# EAGLE design ISRelayV01 (EAGLE 5.06)
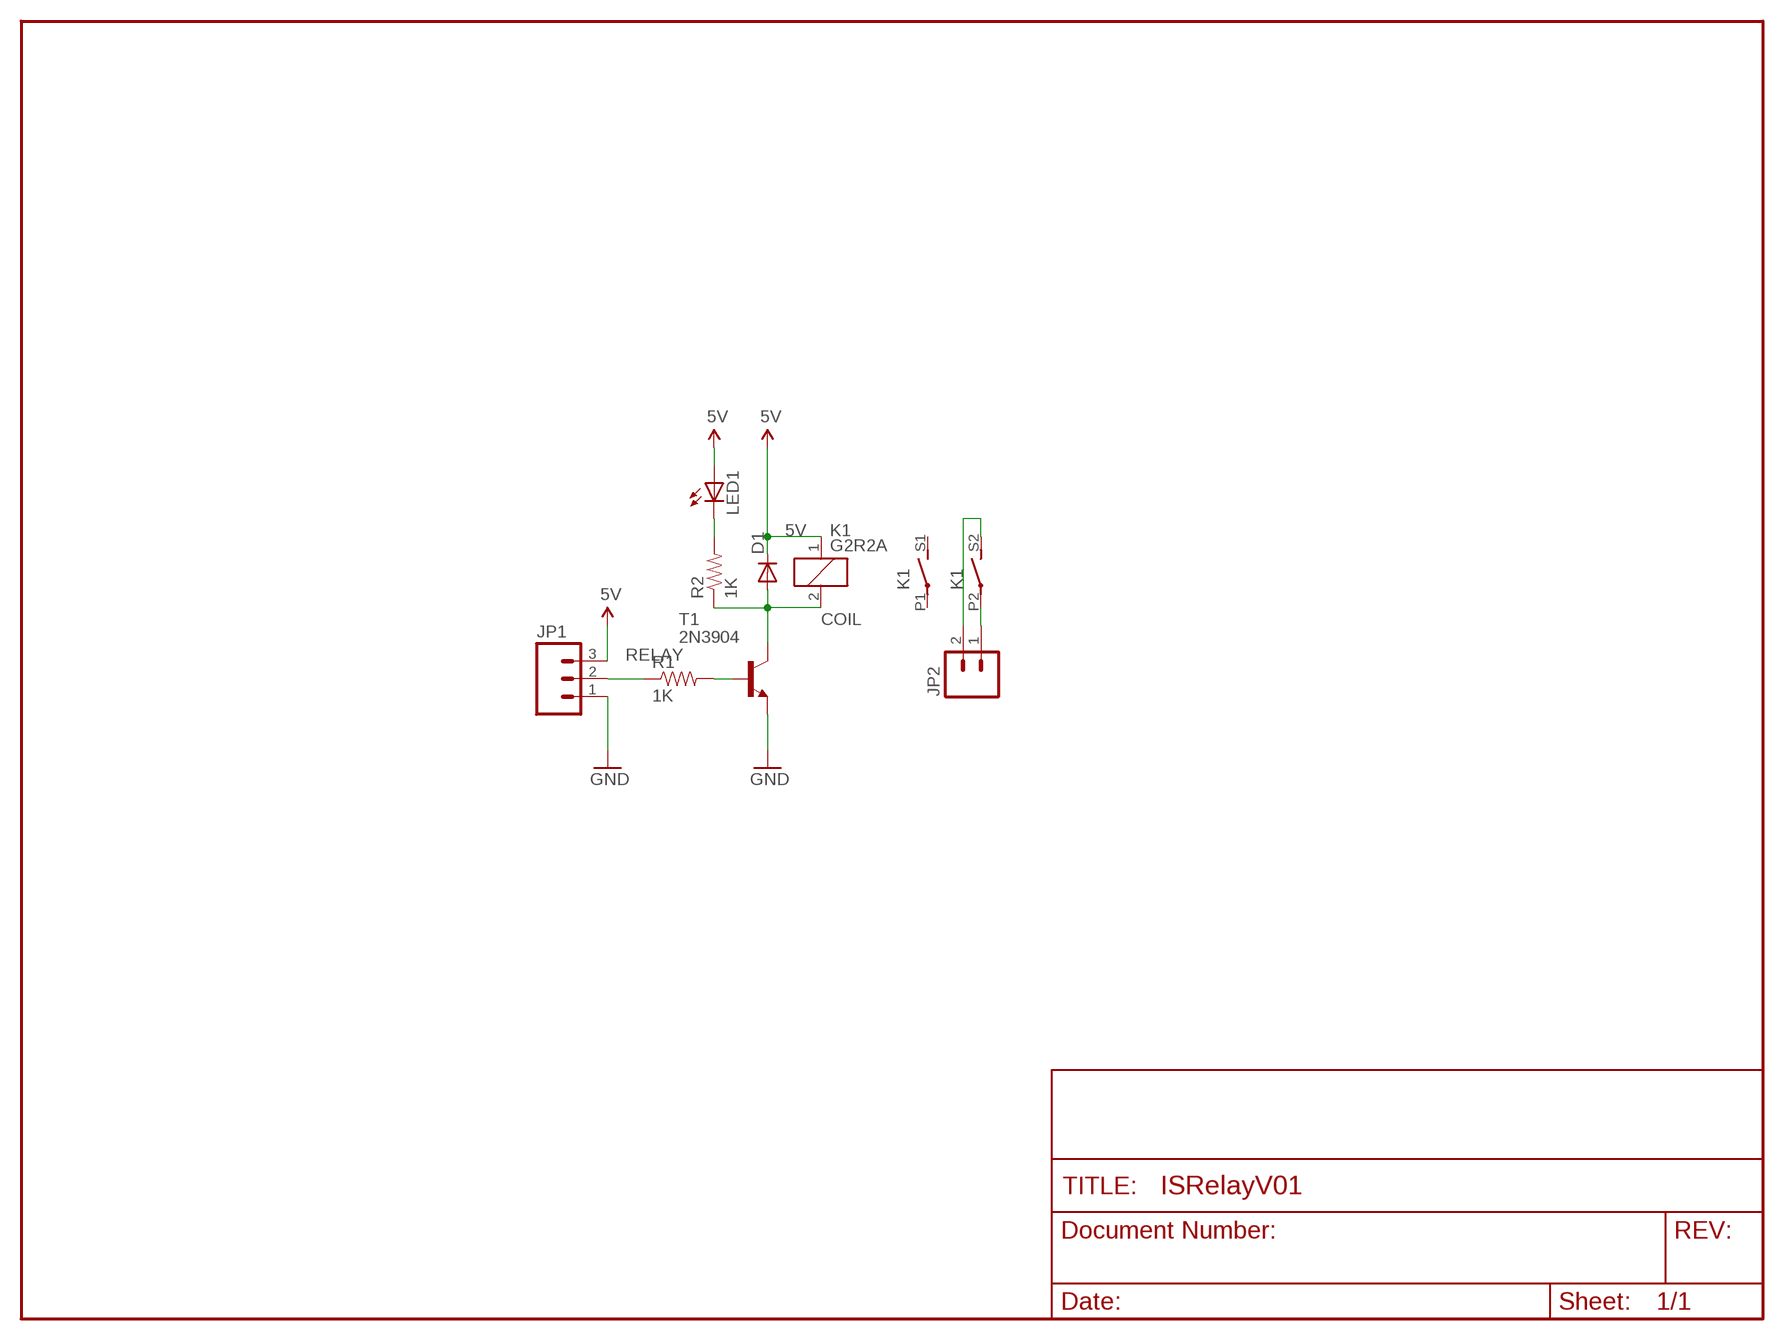
[diagram p0: schematic, sheet 1]

## Parts
D1  DIODE1N4148  [DIODE-1N4148]
JP1  M03SCREW  [SCREWTERMINAL-3.5MM-3]
JP2  M025MM  [SCREWTERMINAL-5MM-2]
K1  G2R2A  [G2R2A]
LED1  LED5MM  [LED5MM]
R1  1K  RESISTORAXIAL-0.3  [AXIAL-0.3]
R2  1K  RESISTORAXIAL-0.3  [AXIAL-0.3]
T1  2N3904  [TO92]

## Nets
5V: D1.C JP1.3 K1.1 LED1.A
COIL: D1.A K1.2 R2.P$1 T1.1(C)
GND: JP1.1 T1.3(E)
N$1: JP2.1 K1.P2(3:P)
N$2: R1.P$2 T1.2(B)
N$3: JP2.2 K1.S2(3:S)
N$4: LED1.K(C) R2.P$2
RELAY: JP1.2 R1.P$1
Unconnected: K1.P1(2:P) K1.S1(2:S)

## Library data of the parts
D1 = SparkFun:DIODE: Diode These are standard reverse protection diodes and small signal diodes. SMA package can handle up to about 1A. SOD-323 can handle about 200mA. What the SOD-323 package when ordering, there are some mfgs out there that are 5-pin packages.
JP1 = SparkFun:M03: Header 3 Standard 3-pin 0.1" header. Use with straight break away headers (SKU : PRT-00116), right angle break away headers (PRT-00553), swiss pins (PRT-00743), machine pins (PRT-00117), and female headers (PRT-00115). Molex polarized connector foot print use with SKU : PRT-08232 with associated crimp pins and housings.
JP2 = SparkFun:M02: Header 2 Standard 2-pin 0.1" header. Use with straight break away headers (SKU : PRT-00116), right angle break away headers (PRT-00553), swiss pins (PRT-00743), machine pins (PRT-00117), and female headers (PRT-00115). Molex polarized connector foot print use with SKU : PRT-08233 with associated crimp pins and housings.
K1 = relay:G2R2A: RELAY 2 x norm. open, Omron
LED1 = SparkFun:LED: LEDs Standard schematic elements and footprints for 5mm, 3mm, 1206, and 0603 sized LEDs. 5mm - Spark Fun Electronics SKU : COM-00529 (and others)
R1 R2 = SparkFun:RESISTOR: Resistor Basic schematic elements and footprints for 0603, 1206, and PTH resistors.
T1 = transistor:2N3904: NPN TRANSISTOR

## Board
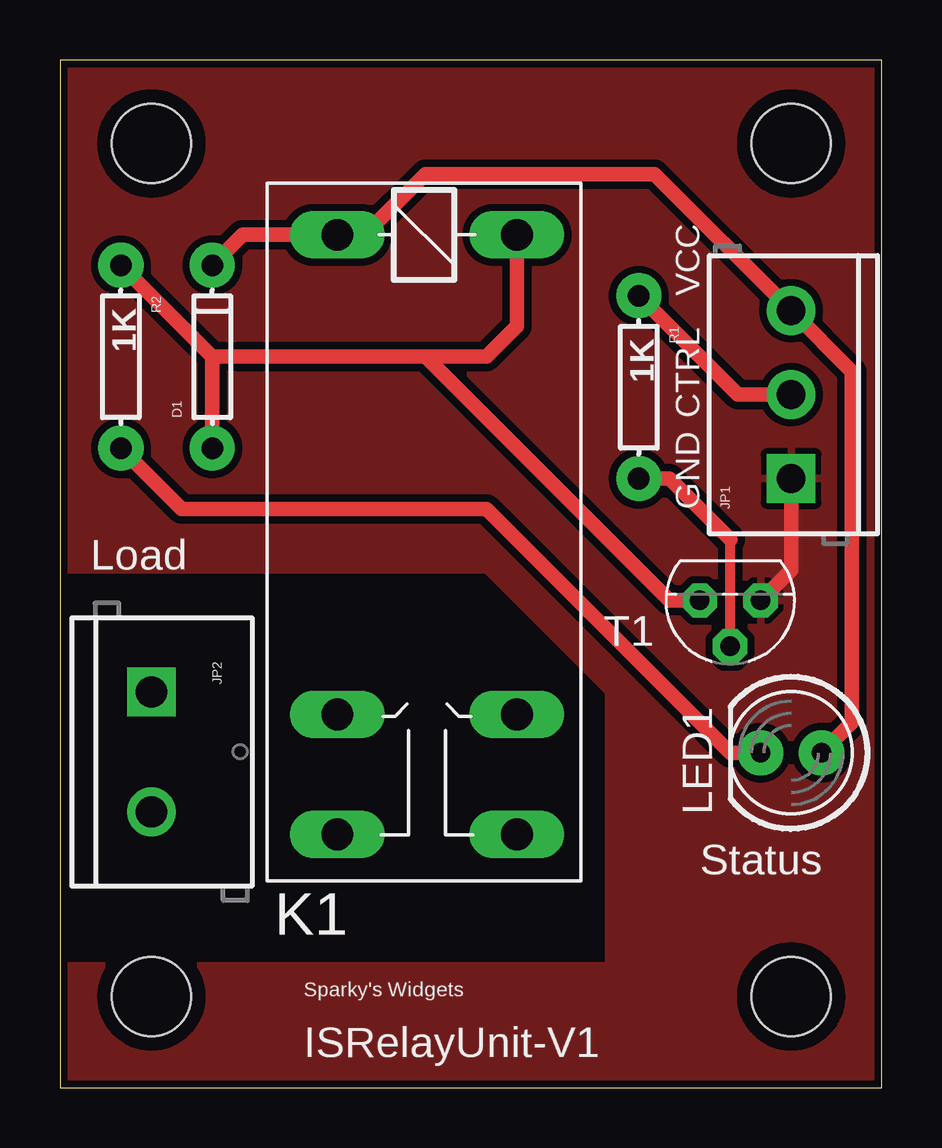
[diagram p1: board, top side]
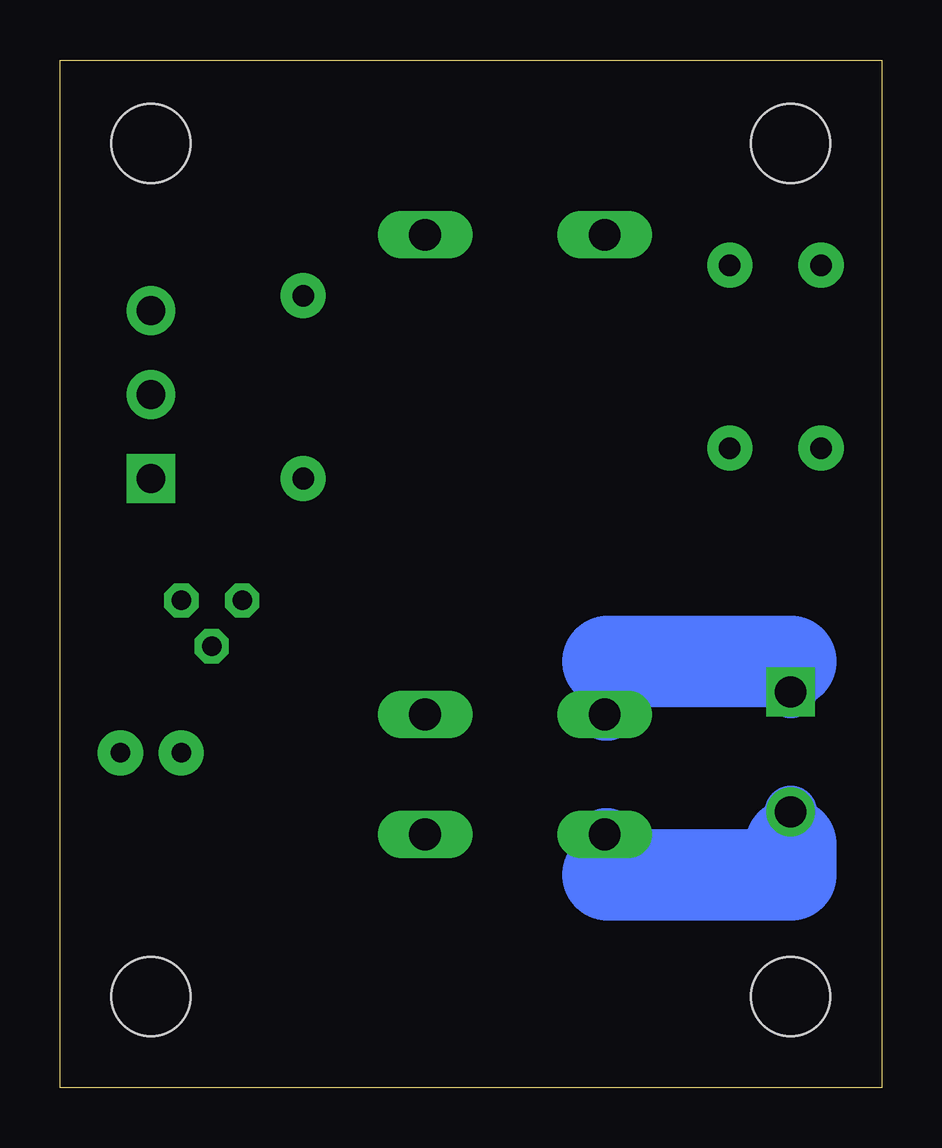
[diagram p2: board, bottom side, seen from below]

Size 34.27 x 42.85 mm. Coordinates in mm from the lower left corner, seen from the top.
Outline: 0,0 34.27,0 34.27,42.85 0,42.85 0,0
Copper layers (1*16): Top 0.035mm / dielectric 1.5mm / Bottom 0.035mm
Design rules "SparkFun": minimum track width 8mil, minimum drill 20mil, track to track 8mil, track to pad 8mil, pad to pad 8mil, via to via 8mil, smd to smd 8mil, copper to edge 10mil, drill to drill 8mil, minimum pad ring 12mil, minimum via ring 10mil, stop-mask expansion 4mil, vias tented up to drill 25mil, thermal gap 10mil

### Footprints (pad centres in the part's own frame; a part is rotated, then mirrored left to right if it is on the bottom)
DIODE-1N4148 = drill 0.9 pad 1.88 round: A -3.81,0; C 3.81,0
SCREWTERMINAL-3.5MM-3 = drill 1.2 pad 2.032 square: 1 0,0 | drill 1.2 pad 2.032 round: 2 3.5,0; 3 7,0
SCREWTERMINAL-5MM-2 = drill 1.3 pad 2.032 square: 1 0,0 | drill 1.3 pad 2.032 round: 2 5,0
G2R2A = drill 1.321 long: 1 -2.54,-3.683; 2 -2.54,3.81; P1 17.45,3.81; P2 17.45,-3.683; S1 22.454,3.81; S2 22.454,-3.683
LED5MM = drill 0.813 pad 1.88 round: A -1.27,0; K 1.27,0
AXIAL-0.3 = drill 0.9 pad 1.88 round: P$1 -3.81,0; P$2 3.81,0
TO92 = drill 0.813 octagon: 1 1.27,0; 2 0,1.905; 3 -1.27,0
STAND-OFF = hole 3.302: 0,0

### Placement (x,y rotation side)
D1  6.35,30.48 90 top
JP1  30.48,25.4 90 top
JP2  3.81,16.51 270 top
K1  15.24,33.02 270 top
LED1  30.48,13.97 180 top
R1  24.13,29.21 270 top
R2  2.54,30.48 270 top
T1  27.94,20.32 180 top
U$4  [STAND-OFF]  3.81,39.37 0 top
U$5  [STAND-OFF]  30.48,39.37 0 top
U$6  [STAND-OFF]  30.48,3.81 0 top
U$7  [STAND-OFF]  3.81,3.81 0 top

### Tracks (layer width: path | path; a pad name or v marks a point on that pad's centre or on a via)
5V
  Top 0.61: LED1.A 33.02,15.24 33.02,29.86 JP1.3 24.78,38.1 15.24,38.1 12.7,35.56 K1.1 7.62,35.56 D1.C
COIL
  Top 0.61: D1.A 6.35,30.48 | 6.35,30.48 R2.P$1 | 6.35,30.48 15.24,30.48 | 15.24,30.48 25.4,20.32 T1.1 | 15.24,30.48 17.78,30.48 19.05,31.75 K1.2
GND
  Top 0.61: T1.3 30.48,21.59 JP1.1
  pour Top (isolate 0.305): 0,43.18 0,21.59 17.78,21.59 22.86,16.51 22.86,5.08 0,5.08 0,0 34.29,0 34.29,43.18
N$1
  Bottom 2.184: K1.P2 11.43,15.57 11.43,17.78 | JP2.1 3.81,17.78
  Bottom 3.81: 3.81,17.78 11.43,17.78
N$2
  Top 0.406: T1.2 27.94,22.86
  Top 0.61: R1.P$2 25.4,25.4 27.94,22.86
N$3
  Bottom 2.184: K1.S2 11.43,10.57 11.43,8.89 | 3.81,10.16 JP2.2
  Bottom 3.81: 11.43,8.89 3.81,8.89 3.81,10.16
N$4
  Top 0.61: LED1.K 27.94,13.97 17.78,24.13 5.08,24.13 R2.P$2
RELAY
  Top 0.61: JP1.2 28.25,28.9 R1.P$1

### Text on the board
tPlace: VCC | CTRL | GND | Load | Status | Sparky's Widgets | ISRelayUnit-V1